# EAGLE design sensor (EAGLE 5.07)
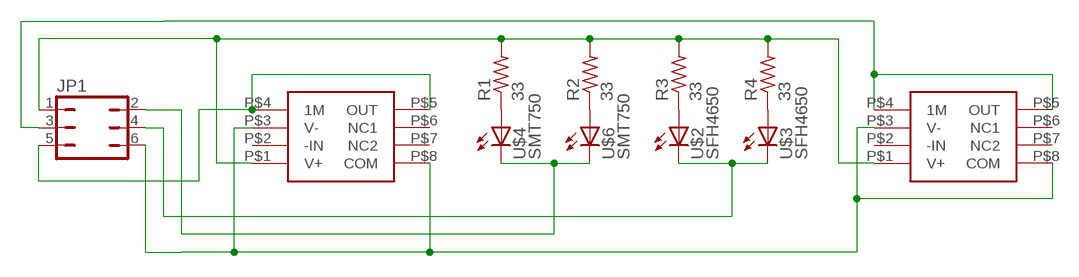
[diagram p0: schematic, sheet 1]

## Parts
JP1  JP3Q  [JP3Q]
R1  33  R-US_R1210  [R1210]
R2  33  R-US_R1210  [R1210]
R3  33  R-US_R1210  [R1210]
R4  33  R-US_R1210  [R1210]
U$1  OPT101  [OPT]
U$2  SFH4650  [MIDLED]
U$3  SFH4650  [MIDLED]
U$4  SMT750  [TOPLED]
U$5  OPT101  [OPT]
U$6  SMT750  [TOPLED]

## Nets
GND: JP1.6 U$1.P$3(V-) U$1.P$8(COM) U$5.P$3(V-) U$5.P$8(COM)
N$1: JP1.5 U$5.P$4(1M) U$5.P$5(OUT)
N$2: JP1.3 U$1.P$4(1M) U$1.P$5(OUT)
N$3: JP1.1 R1.2 R2.2 R3.2 R4.2 U$1.P$1(V+) U$5.P$1(V+)
N$4: R2.1 U$6.P$1(A)
N$5: R1.1 U$4.P$1(A)
N$6: R3.1 U$2.P$1(A)
N$7: R4.1 U$3.P$1(A)
N$8: JP1.2 U$4.P$2(C) U$6.P$2(C)
N$9: JP1.4 U$2.P$2(C) U$3.P$2(C)
Unconnected: U$1.P$2(-IN) U$1.P$6(NC1) U$1.P$7(NC2) U$5.P$2(-IN) U$5.P$6(NC1) U$5.P$7(NC2)

## Library data of the parts
JP1 = jumper:JP3Q: JUMPER
R1-R4 = resistor:R-US_: RESISTOR, American symbol
U$1 U$5 = IRLED:OPT101
U$2 U$3 = IRLED:SFH4650
U$4 U$6 = IRLED:SMT750

## Board
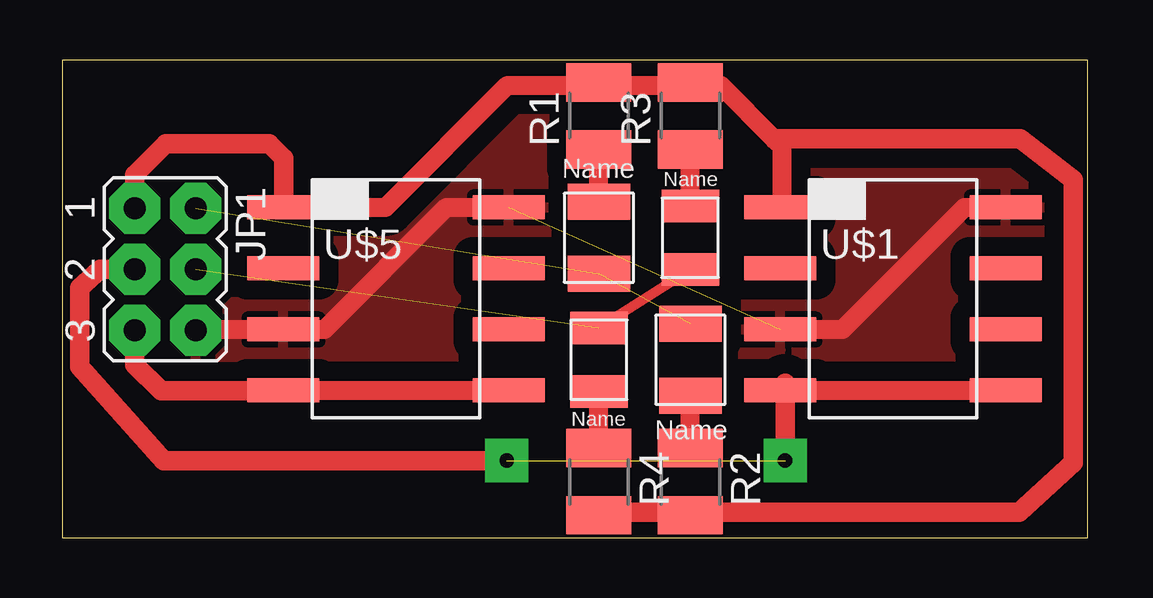
[diagram p1: board, top side]

Size 42.73 x 19.91 mm. Coordinates in mm from the lower left corner, seen from the top.
Outline: 0,0 42.73,0 42.73,19.91 0,19.91 0,0
Copper layers (1*16): Top 0.035mm / dielectric 1.5mm / Bottom 0.035mm
Design rules "FJ043CWRTMEP27Y3QS": minimum track width 0.8mm, minimum drill 0.8mm, track to track 0.8mm, track to pad 0.8mm, pad to pad 0.45mm, via to via 0.8mm, smd to smd 8mil, copper to edge 10mil, drill to drill 8mil, minimum pad ring 0.6mm, minimum via ring 0.6mm, stop-mask expansion 0mil, vias tented up to drill 0mil, thermal gap 10mil

### Footprints (pad centres in the part's own frame; a part is rotated, then mirrored left to right if it is on the bottom)
JP3Q = drill 0.914 octagon: 1 -2.54,-1.27; 2 -2.54,1.27; 3 0,-1.27; 4 0,1.27; 5 2.54,-1.27; 6 2.54,1.27
R1210 = smd 1.6 x 2.7: 1 -1.4,0; 2 1.4,0
OPT = smd 1 x 3: P$1 -3.81,-4.699; P$2 -1.27,-4.699; P$3 1.27,-4.699; P$4 3.81,-4.699; P$5 3.81,4.699; P$6 1.27,4.699; P$7 -1.27,4.699; P$8 -3.81,4.699
MIDLED = smd 2.4 x 1.35: P$1 0,1.325; P$2 0,-1.325
TOPLED = smd 2.6 x 1.5: P$1 0,1.5; P$2 0,-1.5

### Placement (x,y rotation side)
JP1  4.28,11.19 270 top
R1  22.35,17.58 90 top
R2  26.16,2.34 270 top
R3  26.16,17.58 90 top
R4  22.35,2.34 270 top
U$1  34.61,9.96 270 top
U$2  26.16,12.5 0 top
U$3  22.35,7.42 180 top
U$4  22.35,12.5 0 top
U$5  13.9,9.96 270 top
U$6  26.16,7.42 180 top

### Tracks (layer width: path | path; a pad name or v marks a point on that pad's centre or on a via)
GND  (1 unrouted)
  Top 0.8: JP1.6 5.84,8.69 8.38,8.69 U$5.P$3 9.65,8.69 10.92,8.69 16,13.77 18.54,13.77 U$5.P$8 | U$1.P$3 29.97,8.69 32.51,8.69 37.59,13.77 38.86,13.77 U$1.P$8
  pour Top: -0.19,20.12 -0.49,20.12 -0.49,-0.38 43.01,-0.38 43.01,20.62 42.91,20.62 42.91,20.52
N$1
  Top 0.8: U$5.P$4 9.65,6.15 18.54,6.15 U$5.P$5
  Top 0.813: JP1.5 3.01,7.22 4.11,6.12 9.17,6.12 U$5.P$4
N$2  (1 unrouted)
  Top 0.8: U$1.P$4 29.97,6.15 38.86,6.15 U$1.P$5
  Top 0.813: U$1.P$4 30.11,6.45 30.11,3.22 | JP1.3 1.58,11.19 0.71,10.42 0.71,7.12 4.21,3.22 18.51,3.22
N$3
  Top 0.8: 22.35,18.85 26.16,18.85 | 22.35,18.85 R1.2 22.35,18.85 | 26.16,18.85 R3.2 | 22.35,18.85 18.54,18.85 13.46,13.77 9.65,13.77 U$5.P$1 | 27.43,18.85 29.69,16.59 29.97,16.31 29.97,13.77 U$1.P$1 | 26.16,18.85 27.43,18.85 | 26.16,18.85 R3.2 | 22.35,1.07 26.16,1.07 R2.2 | 22.35,1.07 R4.2 22.35,1.07 | R3.2 27.43,18.85
  Top 0.813: 22.35,1.07 39.86,1.07 42.11,3.12 42.11,14.92 39.91,16.62 29.71,16.62 29.69,16.59 | JP1.1 3.01,15.12 4.31,16.42 8.61,16.42 9.21,15.82 U$5.P$1
N$4
  Top 0.8: R2.1 26.16,3.61 R2.1 | R2.1 U$6.P$1 | U$6.P$1 26.16,6.15 U$6.P$1
N$5
  Top 0.8: R1.1 22.35,16.31 R1.1 | U$4.P$1 R1.1 | U$4.P$1 22.35,13.77 U$4.P$1
N$6
  Top 0.8: R3.1 26.16,16.31 R3.1 | U$2.P$1 R3.1 | U$2.P$1 26.16,13.77 U$2.P$1
N$7
  Top 0.8: R4.1 22.35,3.61 R4.1 | R4.1 U$3.P$1 | U$3.P$1 22.35,6.15 U$3.P$1
N$8  (2 unrouted)
N$9  (1 unrouted)
  Top 0.406: U$3.P$2 U$2.P$2
N$10  (via drill 0.6)
  other vias: 30.11,3.22
N$11  (via drill 0.6)
  other vias: 18.51,3.22